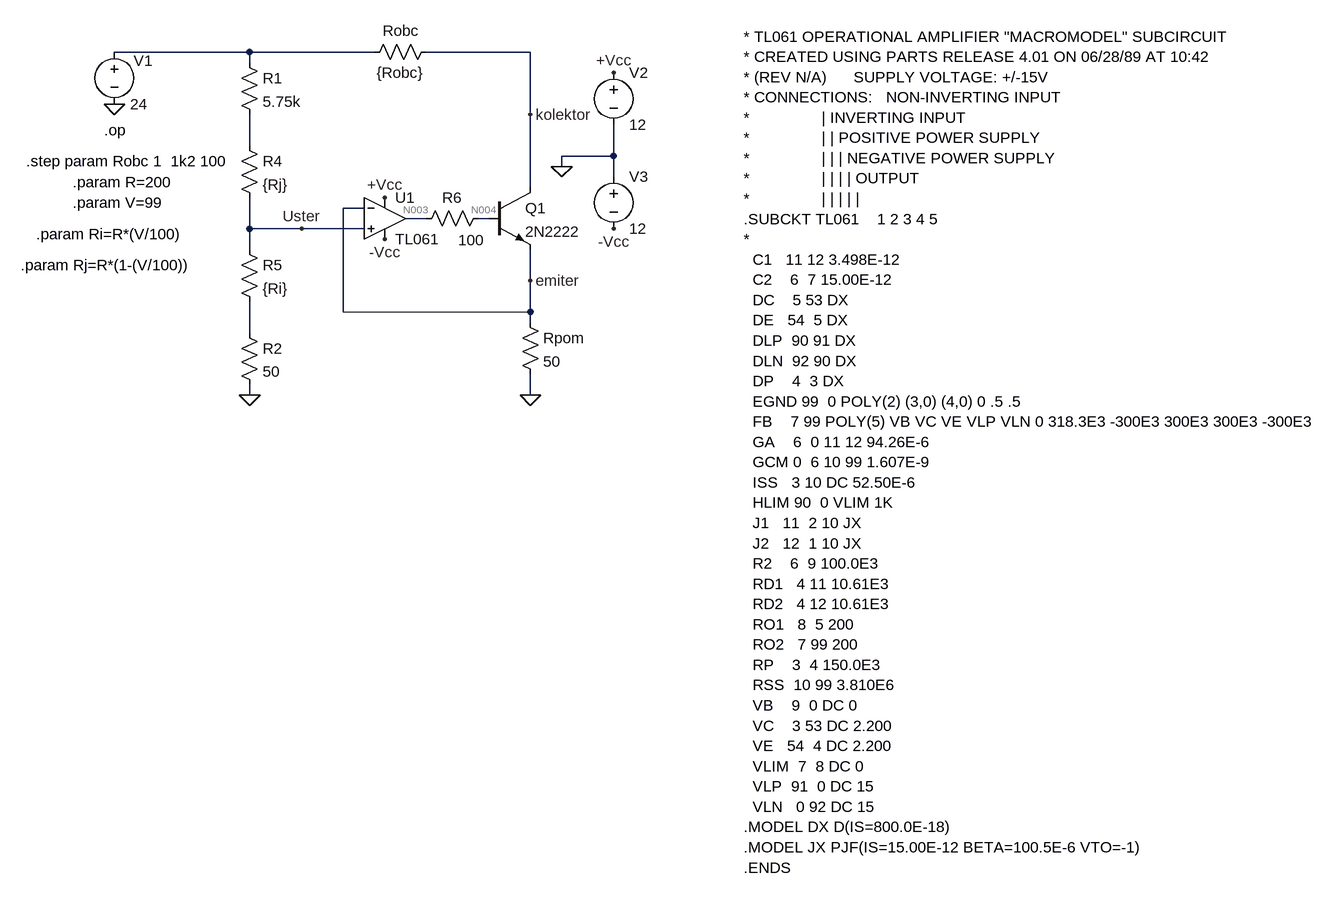
[diagram p0: schematic Uklad1_lab3.asc]
Uklad1_lab3.asc, the LTspice schematic file:
Version 4
SHEET 1 3900 1348
WIRE -16 208 -224 208
WIRE 176 208 -16 208
WIRE 416 208 256 208
WIRE -16 224 -16 208
WIRE 416 304 416 208
WIRE -16 352 -16 304
WIRE 544 368 544 320
WIRE 544 368 464 368
WIRE 464 384 464 368
WIRE 544 400 544 368
WIRE 416 416 416 304
WIRE 160 448 128 448
WIRE 256 464 224 464
WIRE 352 464 336 464
WIRE -16 480 -16 432
WIRE 64 480 -16 480
WIRE 160 480 64 480
WIRE -16 512 -16 480
WIRE 416 560 416 512
WIRE 128 608 128 448
WIRE 416 608 416 560
WIRE 416 608 128 608
WIRE 416 624 416 608
WIRE -16 640 -16 592
WIRE -16 736 -16 720
WIRE 416 736 416 704
FLAG -224 288 0
FLAG -16 736 0
FLAG 416 736 0
FLAG 464 384 0
FLAG 544 240 +Vcc
FLAG 544 480 -Vcc
FLAG 192 432 +Vcc
FLAG 192 496 -Vcc
FLAG 64 480 Uster
FLAG 416 304 kolektor
FLAG 416 560 emiter
SYMBOL res -32 208 R0
SYMATTR InstName R1
SYMATTR Value 5.75k
SYMBOL voltage -224 192 R0
WINDOW 123 0 0 Left 0
WINDOW 39 0 0 Left 0
WINDOW 0 30 29 Left 2
SYMATTR InstName V1
SYMATTR Value 24
SYMBOL OpAmps\\opamp2 192 400 R0
SYMATTR InstName U1
SYMATTR Value TL061
SYMBOL res -32 336 R0
SYMATTR InstName R4
SYMATTR Value {Rj}
SYMBOL res -32 496 R0
SYMATTR InstName R5
SYMATTR Value {Ri}
SYMBOL res -32 624 R0
SYMATTR InstName R2
SYMATTR Value 50
SYMBOL npn 352 416 R0
SYMATTR InstName Q1
SYMATTR Value 2N2222
SYMBOL res 352 448 R90
WINDOW 0 0 56 VBottom 2
WINDOW 3 34 27 VTop 2
SYMATTR InstName R6
SYMATTR Value 100
SYMBOL res 272 192 R90
WINDOW 0 -1 55 VBottom 2
WINDOW 3 32 56 VTop 2
SYMATTR InstName Robc
SYMATTR Value {Robc}
SYMBOL res 400 608 R0
SYMATTR InstName Rpom
SYMATTR Value 50
SYMBOL voltage 544 224 R0
WINDOW 123 0 0 Left 0
WINDOW 39 0 0 Left 0
SYMATTR InstName V2
SYMATTR Value 12
SYMBOL voltage 544 384 R0
WINDOW 123 0 0 Left 0
WINDOW 39 0 0 Left 0
SYMATTR InstName V3
SYMATTR Value 12
TEXT 744 184 Left 2 !* TL061 OPERATIONAL AMPLIFIER "MACROMODEL" SUBCIRCUIT\n* CREATED USING PARTS RELEASE 4.01 ON 06/28/89 AT 10:42\n* (REV N/A)      SUPPLY VOLTAGE: +/-15V\n* CONNECTIONS:   NON-INVERTING INPUT\n*                | INVERTING INPUT\n*                | | POSITIVE POWER SUPPLY\n*                | | | NEGATIVE POWER SUPPLY\n*                | | | | OUTPUT\n*                | | | | |\n.SUBCKT TL061    1 2 3 4 5\n*\n  C1   11 12 3.498E-12\n  C2    6  7 15.00E-12\n  DC    5 53 DX\n  DE   54  5 DX\n  DLP  90 91 DX\n  DLN  92 90 DX\n  DP    4  3 DX\n  EGND 99  0 POLY(2) (3,0) (4,0) 0 .5 .5\n  FB    7 99 POLY(5) VB VC VE VLP VLN 0 318.3E3 -300E3 300E3 300E3 -300E3\n  GA    6  0 11 12 94.26E-6\n  GCM 0  6 10 99 1.607E-9\n  ISS   3 10 DC 52.50E-6\n  HLIM 90  0 VLIM 1K\n  J1   11  2 10 JX\n  J2   12  1 10 JX\n  R2    6  9 100.0E3\n  RD1   4 11 10.61E3\n  RD2   4 12 10.61E3\n  RO1   8  5 200\n  RO2   7 99 200\n  RP    3  4 150.0E3\n  RSS  10 99 3.810E6\n  VB    9  0 DC 0\n  VC    3 53 DC 2.200\n  VE   54  4 DC 2.200\n  VLIM  7  8 DC 0\n  VLP  91  0 DC 15\n  VLN   0 92 DC 15\n.MODEL DX D(IS=800.0E-18)\n.MODEL JX PJF(IS=15.00E-12 BETA=100.5E-6 VTO=-1)\n.ENDS
TEXT -288 440 Left 2 !.param V=99
TEXT -240 328 Left 2 !.op
TEXT -288 408 Left 2 !.param R=200
TEXT -344 488 Left 2 !.param Ri=R*(V/100)
TEXT -368 536 Left 2 !.param Rj=R*(1-(V/100))
TEXT -360 376 Left 2 !.step param Robc 1  1k2 100

The netlist it stands for:
* Uklad1_lab3.asc
R1 N001 N002 5.75k
V1 N001 0 24
XU1 Uster emiter +Vcc -Vcc N003 TL061  ; pins In+ In- V+ V- OUT
R4 N002 Uster {Rj}
R5 Uster N005 {Ri}
R2 N005 0 50
Q1 kolektor N004 emiter 0 2N2222
R6 N004 N003 100
Robc kolektor N001 {Robc}
Rpom emiter 0 50
V2 +Vcc 0 12
V3 0 -Vcc 12
.model NPN NPN
.model PNP PNP
.lib standard.bjt
* TL061 OPERATIONAL AMPLIFIER "MACROMODEL" SUBCIRCUIT
* CREATED USING PARTS RELEASE 4.01 ON 06/28/89 AT 10:42
* (REV N/A)      SUPPLY VOLTAGE: +/-15V
* CONNECTIONS:   NON-INVERTING INPUT
*                | INVERTING INPUT
*                | | POSITIVE POWER SUPPLY
*                | | | NEGATIVE POWER SUPPLY
*                | | | | OUTPUT
*                | | | | |
.SUBCKT TL061    1 2 3 4 5
*
  C1   11 12 3.498E-12
  C2    6  7 15.00E-12
  DC    5 53 DX
  DE   54  5 DX
  DLP  90 91 DX
  DLN  92 90 DX
  DP    4  3 DX
  EGND 99  0 POLY(2) (3,0) (4,0) 0 .5 .5
  FB    7 99 POLY(5) VB VC VE VLP VLN 0 318.3E3 -300E3 300E3 300E3 -300E3
  GA    6  0 11 12 94.26E-6
  GCM 0  6 10 99 1.607E-9
  ISS   3 10 DC 52.50E-6
  HLIM 90  0 VLIM 1K
  J1   11  2 10 JX
  J2   12  1 10 JX
  R2    6  9 100.0E3
  RD1   4 11 10.61E3
  RD2   4 12 10.61E3
  RO1   8  5 200
  RO2   7 99 200
  RP    3  4 150.0E3
  RSS  10 99 3.810E6
  VB    9  0 DC 0
  VC    3 53 DC 2.200
  VE   54  4 DC 2.200
  VLIM  7  8 DC 0
  VLP  91  0 DC 15
  VLN   0 92 DC 15
.MODEL DX D(IS=800.0E-18)
.MODEL JX PJF(IS=15.00E-12 BETA=100.5E-6 VTO=-1)
.ENDS
.param V=99
.op
.param R=200
.param Ri=R*(V/100)
.param Rj=R*(1-(V/100))
.step param Robc 1  1k2 100
.backanno
.end

* Results of the author's LTspice run, read from the files saved beside the schematic
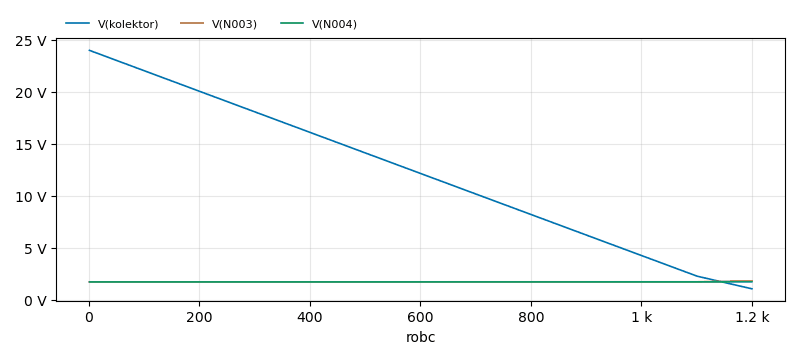
[diagram p1: Operating Point of Uklad1_lab3.asc, plotted from the saved traces]
* Operating Point, 1 run:
*   V(kolektor): 23.98 V at robc=1 , 1.067 V at robc=1.2 k, min 1.067 V, max 23.98 V
*   V(N003): 1.733 V at robc=1 , 1.811 V at robc=1.2 k, min 1.733 V, max 1.811 V
*   V(N004): 1.725 V at robc=1 , 1.739 V at robc=1.2 k, min 1.725 V, max 1.739 V